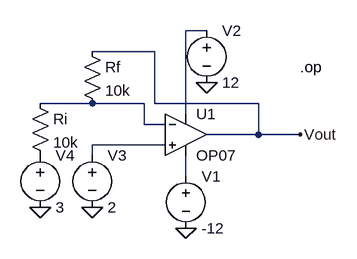
[diagram p0: schematic Superposition.asc]
Superposition.asc, the LTspice schematic file:
Version 4
SHEET 1 880 680
WIRE 240 0 208 0
WIRE 160 32 64 32
WIRE 64 112 -16 112
WIRE 144 112 64 112
WIRE 160 112 160 32
WIRE 320 112 160 112
WIRE 208 128 208 0
WIRE 144 144 144 112
WIRE 176 144 144 144
WIRE 320 160 320 112
WIRE 320 160 240 160
WIRE 384 160 320 160
WIRE 176 176 64 176
WIRE 64 192 64 176
WIRE 208 224 208 192
FLAG -16 272 0
FLAG 64 272 0
FLAG 208 304 0
FLAG 240 80 0
FLAG 384 160 Vout
SYMBOL OpAmps\\OP07 208 96 R0
SYMATTR InstName U1
SYMBOL voltage 208 208 R0
WINDOW 123 0 0 Left 0
WINDOW 39 0 0 Left 0
SYMATTR InstName V1
SYMATTR Value -12
SYMBOL voltage 240 -16 R0
WINDOW 123 0 0 Left 0
WINDOW 39 0 0 Left 0
SYMATTR InstName V2
SYMATTR Value 12
SYMBOL voltage 64 176 R0
WINDOW 123 0 0 Left 0
WINDOW 39 0 0 Left 0
SYMATTR InstName V3
SYMATTR Value 2
SYMBOL voltage -16 176 R0
WINDOW 123 0 0 Left 0
WINDOW 39 0 0 Left 0
SYMATTR InstName V4
SYMATTR Value 3
SYMBOL res -32 96 R0
SYMATTR InstName Ri
SYMATTR Value 10k
SYMBOL res 48 16 R0
SYMATTR InstName Rf
SYMATTR Value 10k
TEXT 384 56 Left 2 !.op

The netlist it stands for:
* Superposition.asc
XU1 N003 N002 N001 N004 Vout LT1001  ; OP07, pins In+ In- V+ V- OUT
V1 N004 0 -12
V2 N001 0 12
V3 N003 0 2
V4 P001 0 3
Ri N002 P001 10k
Rf Vout N002 10k
.op
.lib LTC.lib
.backanno
.end